# Altium schematic sheet Oscilador.SchDoc
size A
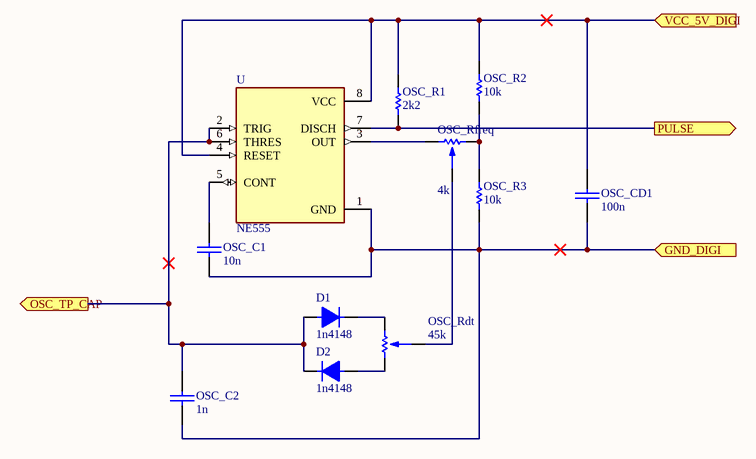
[diagram p0: Oscilador.SchDoc]

## Parts
D1  1n4148  [DO41]
D2  1n4148  [DO41]
OSC_C1  10n  [CAP200]
OSC_C2  1n  [CAP200]
OSC_CD1  100n  [CAP200]
OSC_R1  2k2  [RES400]
OSC_R2  10k  [RES400]
OSC_R3  10k  [RES400]
OSC_Rdt  45k  [POTENCIOMETRO]
OSC_Rfreq  4k  [POTENCIOMETRO]
U  NE555  [DIP794W45P254L1060H508Q8]

## Ports
GND_DIGI (in), OSC_TP_CAP (out), PULSE (out), VCC_5V_DIGI (in)

## Nets
GND_DIGI: OSC_C1.2 OSC_C2.2 OSC_CD1.2 OSC_R3.1 U.1(GND) ; port GND_DIGI
OSC_TP_CAP: D1.1 D2.2 OSC_C2.1 U.2(TRIG) U.6(THRES) ; port OSC_TP_CAP
PULSE: OSC_R1.1 U.7(DISCH) ; port PULSE
VCC_5V_DIGI: OSC_CD1.1 OSC_R1.2 OSC_R2.2 U.4(RESET) U.8(VCC) ; port VCC_5V_DIGI
NetD1_2: D1.2 OSC_Rdt.1
NetD2_1: D2.1 OSC_Rdt.3
NetOSC_C1_1: OSC_C1.1 U.5(CONT)
NetOSC_R2_1: OSC_R2.1 OSC_R3.2 OSC_Rfreq.1
NetOSC_Rdt_2: OSC_Rdt.2 OSC_Rfreq.2
NetOSC_Rfreq_3: OSC_Rfreq.3 U.3(OUT)

## Library data of the parts
D1 D2 = DIODO
OSC_C1 OSC_C2 OSC_CD1 = CAP
OSC_R1-OSC_R3 = RES
OSC_Rdt OSC_Rfreq = POTENCIOMETRO
U = NE555: 555 Type, Timer/Oscillator _Single_ IC 100kHz 8-SOIC; MF: Texas Instruments; Package: SOIC-8 Conrad; Availability: Unavailable; MP: NE555; Value: *; SnapEDA_Link: https://www.snapeda.com/parts/NE555/Texas%20Instruments/view-part/1756807/?ref=snap; Price: None